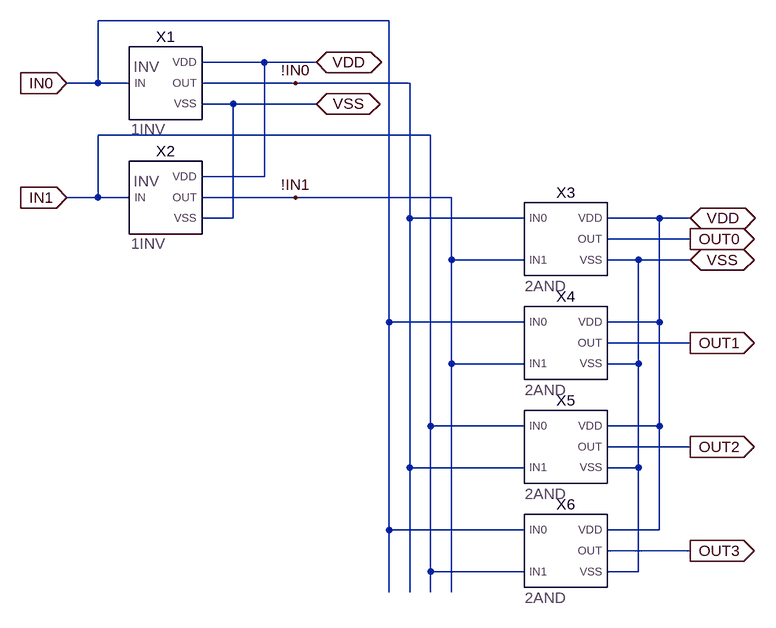
[diagram p0: schematic 2BTO4D.asc]
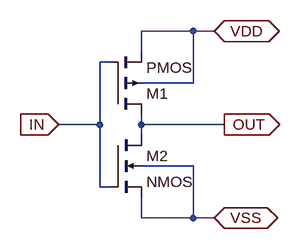
[diagram p1: sub-circuit 1inv.asc]
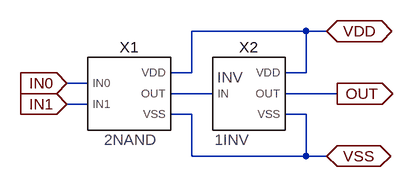
[diagram p2: sub-circuit 2and.asc]
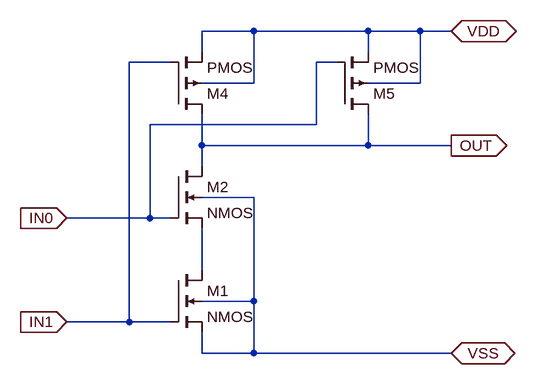
[diagram p3: sub-circuit 2nand.asc]
2BTO4D.asc, the LTspice schematic file:
Version 4
SHEET 1 880 988
WIRE -16 -688 -464 -688
WIRE -208 -624 -304 -624
WIRE -128 -624 -208 -624
WIRE -464 -592 -464 -688
WIRE -464 -592 -512 -592
WIRE -416 -592 -464 -592
WIRE -160 -592 -304 -592
WIRE 16 -592 -160 -592
WIRE -256 -560 -304 -560
WIRE -128 -560 -256 -560
WIRE 48 -512 -464 -512
WIRE -208 -448 -208 -624
WIRE -208 -448 -304 -448
WIRE -464 -416 -464 -512
WIRE -464 -416 -512 -416
WIRE -416 -416 -464 -416
WIRE -160 -416 -304 -416
WIRE 80 -416 -160 -416
WIRE -256 -384 -256 -560
WIRE -256 -384 -304 -384
WIRE 16 -384 16 -592
WIRE 192 -384 16 -384
WIRE 400 -384 320 -384
WIRE 448 -384 400 -384
WIRE 448 -352 320 -352
WIRE 80 -320 80 -416
WIRE 192 -320 80 -320
WIRE 368 -320 320 -320
WIRE 448 -320 368 -320
WIRE -16 -224 -16 -688
WIRE 192 -224 -16 -224
WIRE 400 -224 400 -384
WIRE 400 -224 320 -224
WIRE 448 -192 320 -192
WIRE 80 -160 80 -320
WIRE 192 -160 80 -160
WIRE 368 -160 368 -320
WIRE 368 -160 320 -160
WIRE 48 -64 48 -512
WIRE 192 -64 48 -64
WIRE 400 -64 400 -224
WIRE 400 -64 320 -64
WIRE 448 -32 320 -32
WIRE 16 0 16 -384
WIRE 192 0 16 0
WIRE 368 0 368 -160
WIRE 368 0 320 0
WIRE -16 96 -16 -224
WIRE 192 96 -16 96
WIRE 400 96 400 -64
WIRE 400 96 320 96
WIRE 448 128 320 128
WIRE 48 160 48 -64
WIRE 192 160 48 160
WIRE 368 160 368 0
WIRE 368 160 320 160
WIRE -16 192 -16 96
WIRE 16 192 16 0
WIRE 48 192 48 160
WIRE 80 192 80 -160
FLAG -512 -592 IN0
IOPIN -512 -592 In
FLAG -512 -416 IN1
IOPIN -512 -416 In
FLAG -160 -592 !IN0
FLAG -160 -416 !IN1
FLAG -128 -560 VSS
IOPIN -128 -560 BiDir
FLAG -128 -624 VDD
IOPIN -128 -624 BiDir
FLAG 448 -384 VDD
IOPIN 448 -384 BiDir
FLAG 448 -320 VSS
IOPIN 448 -320 BiDir
FLAG 448 -352 OUT0
IOPIN 448 -352 Out
FLAG 448 -192 OUT1
IOPIN 448 -192 Out
FLAG 448 -32 OUT2
IOPIN 448 -32 Out
FLAG 448 128 OUT3
IOPIN 448 128 Out
SYMBOL 1INV -368 -592 R0
SYMATTR InstName X1
SYMBOL 1INV -368 -416 R0
SYMATTR InstName X2
SYMBOL 2AND 256 -352 R0
SYMATTR InstName X3
SYMBOL 2AND 256 -192 R0
SYMATTR InstName X4
SYMBOL 2AND 256 -32 R0
SYMATTR InstName X5
SYMBOL 2AND 256 128 R0
SYMATTR InstName X6

1inv.asc, the sub-circuit schematic file:
Version 4
SHEET 1 880 680
WIRE 224 -16 144 -16
WIRE 256 -16 224 -16
WIRE 144 16 144 -16
WIRE 96 32 80 32
WIRE 224 64 224 -16
WIRE 224 64 144 64
WIRE 80 128 80 32
WIRE 80 128 16 128
WIRE 144 128 144 112
WIRE 272 128 144 128
WIRE 144 144 144 128
WIRE 224 192 144 192
WIRE 80 224 80 128
WIRE 96 224 80 224
WIRE 144 272 144 240
WIRE 224 272 224 192
WIRE 224 272 144 272
WIRE 256 272 224 272
FLAG 16 128 IN
IOPIN 16 128 In
FLAG 272 128 OUT
IOPIN 272 128 Out
FLAG 256 -16 VDD
IOPIN 256 -16 BiDir
FLAG 256 272 VSS
IOPIN 256 272 BiDir
SYMBOL pmos4 96 112 M180
SYMATTR InstName M1
SYMATTR Value2 l=110nM w=180nM
SYMBOL nmos4 96 144 R0
SYMATTR InstName M2
SYMATTR Value2 l=110nM w=180nM

2and.asc, the sub-circuit schematic file:
Version 4
SHEET 1 1048 680
WIRE 656 -32 480 -32
WIRE 688 -32 656 -32
WIRE 480 32 480 -32
WIRE 480 32 448 32
WIRE 656 32 656 -32
WIRE 656 32 624 32
WIRE 320 48 288 48
WIRE 512 64 448 64
WIRE 704 64 624 64
WIRE 320 80 288 80
WIRE 480 96 448 96
WIRE 656 96 624 96
WIRE 480 160 480 96
WIRE 656 160 656 96
WIRE 656 160 480 160
WIRE 688 160 656 160
FLAG 704 64 OUT
IOPIN 704 64 Out
FLAG 688 -32 VDD
IOPIN 688 -32 BiDir
FLAG 688 160 VSS
IOPIN 688 160 BiDir
FLAG 288 48 IN0
IOPIN 288 48 In
FLAG 288 80 IN1
IOPIN 288 80 In
SYMBOL 1INV 560 64 R0
SYMATTR InstName X2
SYMBOL 2NAND 384 64 R0
SYMATTR InstName X1

2nand.asc, the sub-circuit schematic file:
Version 4
SHEET 1 880 680
WIRE 224 -224 144 -224
WIRE 400 -224 224 -224
WIRE 480 -224 400 -224
WIRE 528 -224 480 -224
WIRE 144 -192 144 -224
WIRE 400 -192 400 -224
WIRE 96 -176 32 -176
WIRE 352 -176 320 -176
WIRE 224 -144 224 -224
WIRE 224 -144 144 -144
WIRE 480 -144 480 -224
WIRE 480 -144 400 -144
WIRE 320 -80 320 -176
WIRE 320 -80 64 -80
WIRE 144 -48 144 -96
WIRE 400 -48 400 -96
WIRE 400 -48 144 -48
WIRE 528 -48 400 -48
WIRE 144 -16 144 -48
WIRE 224 32 144 32
WIRE 64 64 64 -80
WIRE 64 64 -64 64
WIRE 96 64 64 64
WIRE 144 144 144 80
WIRE 224 192 224 32
WIRE 224 192 144 192
WIRE 32 224 32 -176
WIRE 32 224 -64 224
WIRE 96 224 32 224
WIRE 144 272 144 240
WIRE 224 272 224 192
WIRE 224 272 144 272
WIRE 528 272 224 272
FLAG 528 -224 VDD
IOPIN 528 -224 BiDir
FLAG 528 272 VSS
IOPIN 528 272 BiDir
FLAG -64 64 IN0
IOPIN -64 64 In
FLAG -64 224 IN1
IOPIN -64 224 In
FLAG 528 -48 OUT
IOPIN 528 -48 Out
SYMBOL nmos4 96 144 R0
SYMATTR InstName M1
SYMATTR Value2 l=110n w=180n
SYMBOL nmos4 96 -16 R0
SYMATTR InstName M2
SYMATTR Value2 l=110n w=180n
SYMBOL pmos4 96 -96 M180
SYMATTR InstName M4
SYMATTR Value2 l=110n w=180n
SYMBOL pmos4 352 -96 M180
SYMATTR InstName M5
SYMATTR Value2 l=110n w=180n

The netlist it stands for:
* 2BTO4D.asc
XX1 IN0 !IN0 VDD VSS 1inv
XX2 IN1 !IN1 VDD VSS 1inv
XX3 !IN0 !IN1 OUT0 VDD VSS 2and
XX4 IN0 !IN1 OUT1 VDD VSS 2and
XX5 IN1 !IN0 OUT2 VDD VSS 2and
XX6 IN0 IN1 OUT3 VDD VSS 2and

* block symbol definitions
.subckt 1inv IN OUT VDD VSS
M1 OUT IN VDD VDD PMOS l=110nM w=180nM
M2 OUT IN VSS VSS NMOS l=110nM w=180nM
.ends 1inv

.subckt 2and IN0 IN1 OUT VDD VSS
XX2 N001 OUT VDD VSS 1inv
XX1 IN0 IN1 N001 VDD VSS 2nand
.ends 2and

.subckt 2nand IN0 IN1 OUT VDD VSS
M1 N001 IN1 VSS VSS NMOS l=110n w=180n
M2 OUT IN0 N001 VSS NMOS l=110n w=180n
M4 OUT IN1 VDD VDD PMOS l=110n w=180n
M5 OUT IN0 VDD VDD PMOS l=110n w=180n
.ends 2nand

.model NMOS NMOS
.model PMOS PMOS
.lib standard.mos
.backanno
.end